# EAGLE design osbee_shield_1.0 (EAGLE 6.5.0)
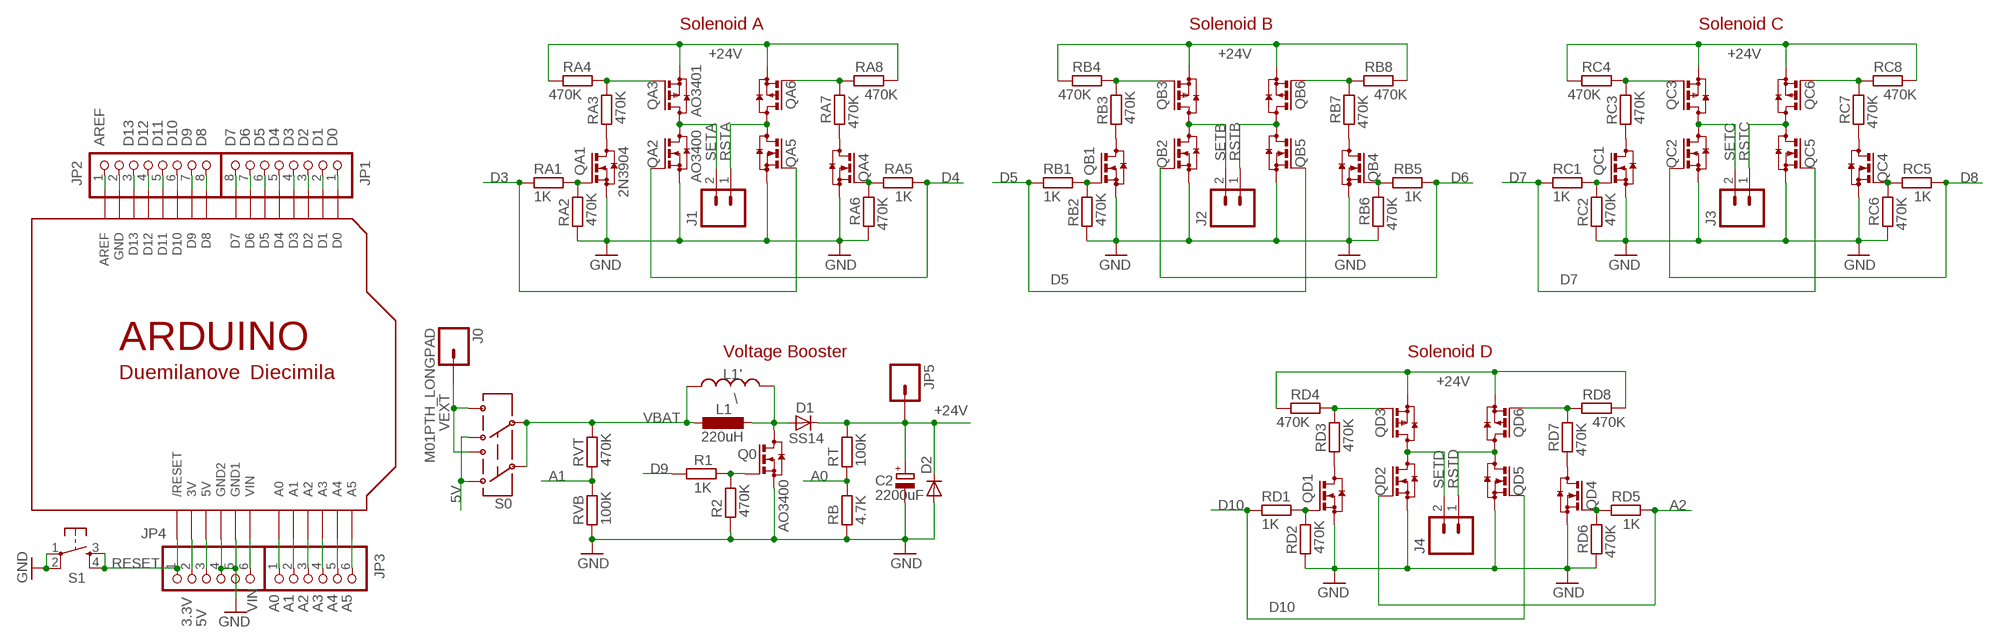
[diagram p0: schematic, sheet 1]

## Parts
C2  2200uF  CPOL-EUE5-13  [E5-13]
D1  SS14  DIODE-DO-214AC  [DO-214AC]
D2  DIODE-MINIMELF  [MINIMELF]
J0  M01PTH_LONGPAD  [1X01_LONGPAD]
J1  M025MM  [SCREWTERMINAL-5MM-2]
J2  M025MM  [SCREWTERMINAL-5MM-2]
J3  M025MM  [SCREWTERMINAL-5MM-2]
J4  M025MM  [SCREWTERMINAL-5MM-2]
JP1  PINHD-1X8BIG  [1X08-BIG]
JP2  PINHD-1X8BIG  [1X08-BIG]
JP3  PINHD-1X6B  [1X06-BIG]
JP4  PINHD-1X6B  [1X06-BIG]
JP5  M01SMDNS  [1X01NS]
L1  220uH  L-EU0204/5  [0204/5]
L1'  \  INDUCTOR_SMDD58  [INDUCTOR_D58]
Q0  AO3400  BSS123  [SOT23]
QA1  2N3904  BSS123  [SOT23]
QA2  AO3400  BSS123  [SOT23]
QA3  AO3401  BSS84  [SOT23]
QA4  BSS123  [SOT23]
QA5  BSS123  [SOT23]
QA6  BSS84  [SOT23]
QB1  BSS123  [SOT23]
QB2  BSS123  [SOT23]
QB3  BSS84  [SOT23]
QB4  BSS123  [SOT23]
QB5  BSS123  [SOT23]
QB6  BSS84  [SOT23]
QC1  BSS123  [SOT23]
QC2  BSS123  [SOT23]
QC3  BSS84  [SOT23]
QC4  BSS123  [SOT23]
QC5  BSS123  [SOT23]
QC6  BSS84  [SOT23]
QD1  BSS123  [SOT23]
QD2  BSS123  [SOT23]
QD3  BSS84  [SOT23]
QD4  BSS123  [SOT23]
QD5  BSS123  [SOT23]
QD6  BSS84  [SOT23]
R1  1K  R-EU_R0805  [R0805]
R2  470K  R-EU_R0805  [R0805]
RA1  1K  R-EU_R0805  [R0805]
RA2  470K  R-EU_R0805  [R0805]
RA3  470K  R-EU_R0805  [R0805]
RA4  470K  R-EU_R0805  [R0805]
RA5  1K  R-EU_R0805  [R0805]
RA6  470K  R-EU_R0805  [R0805]
RA7  470K  R-EU_R0805  [R0805]
RA8  470K  R-EU_R0805  [R0805]
RB  4.7K  R-EU_R0805  [R0805]
RB1  1K  R-EU_R0805  [R0805]
RB2  470K  R-EU_R0805  [R0805]
RB3  470K  R-EU_R0805  [R0805]
RB4  470K  R-EU_R0805  [R0805]
RB5  1K  R-EU_R0805  [R0805]
RB6  470K  R-EU_R0805  [R0805]
RB7  470K  R-EU_R0805  [R0805]
RB8  470K  R-EU_R0805  [R0805]
RC1  1K  R-EU_R0805  [R0805]
RC2  470K  R-EU_R0805  [R0805]
RC3  470K  R-EU_R0805  [R0805]
RC4  470K  R-EU_R0805  [R0805]
RC5  1K  R-EU_R0805  [R0805]
RC6  470K  R-EU_R0805  [R0805]
RC7  470K  R-EU_R0805  [R0805]
RC8  470K  R-EU_R0805  [R0805]
RD1  1K  R-EU_R0805  [R0805]
RD2  470K  R-EU_R0805  [R0805]
RD3  470K  R-EU_R0805  [R0805]
RD4  470K  R-EU_R0805  [R0805]
RD5  1K  R-EU_R0805  [R0805]
RD6  470K  R-EU_R0805  [R0805]
RD7  470K  R-EU_R0805  [R0805]
RD8  470K  R-EU_R0805  [R0805]
RT  100K  R-EU_R0805  [R0805]
RVB  100K  R-EU_R0805  [R0805]
RVT  470K  R-EU_R0805  [R0805]
S0  AYZ0202  [AYZ0202]
S1  TAC_SWITCHPTH  [TACTILE-PTH]
U$1  ARDUINODUEMILANOVE-NODIM  [ARDUINO-NODIM]

## Nets
3.3V: JP4.2 U$1.3V
5V [power]: JP4.3 S0.3 S0.6 U$1.5V
+24V [power]: C2.+ D1.C D2.C JP5.1 QA3.2(S) QA6.2(S) QB3.2(S) QB6.2(S) QC3.2(S) QC6.2(S) QD3.2(S) QD6.2(S) RA4.2 RA8.2 RB4.2 RB8.2 RC4.2 RC8.2 RD4.2 RD8.2 RT.2
A0: JP3.1 RB.2 RT.1 U$1.A0
A1: JP3.2 RVB.2 RVT.1 U$1.A1
A2: JP3.3 QD2.1(G) RD5.1 U$1.A2
A3: JP3.4 U$1.A3
A4: JP3.5 U$1.A4
A5: JP3.6 U$1.A5
AREF: JP2.1 U$1.AREF
D0: JP1.1 U$1.D0
D1: JP1.2 U$1.D1
D2: JP1.3 U$1.D2
D3: JP1.4 QA5.1(G) RA1.1 U$1.D3
D4: JP1.5 QA2.1(G) RA5.1 U$1.D4
D5: JP1.6 QB5.1(G) RB1.1 U$1.D5
D6: JP1.7 QB2.1(G) RB5.1 U$1.D6
D7: JP1.8 QC5.1(G) RC1.1 U$1.D7
D8: JP2.8 QC2.1(G) RC5.1 U$1.D8
D9: JP2.7 R1.2 U$1.D9
D10: JP2.6 QD5.1(G) RD1.1 U$1.D10
D11: JP2.5 U$1.D11
D12: JP2.4 U$1.D12
D13: JP2.3 U$1.D13
GND: C2.- D2.A JP4.4 JP4.5 Q0.2(S) QA1.2(S) QA2.2(S) QA4.2(S) QA5.2(S) QB1.2(S) QB2.2(S) QB4.2(S) QB5.2(S) QC1.2(S) QC2.2(S) QC4.2(S) QC5.2(S) QD1.2(S) QD2.2(S) QD4.2(S) QD5.2(S) R2.1 RA2.1 RA6.1 RB2.1 RB6.1 RB.1 RC2.1 RC6.1 RD2.1 RD6.1 RVB.1 S1.1 S1.2 U$1.GND1 U$1.GND2
N$1: QA1.3(D) RA3.1
N$2: Q0.1(G) R1.1 R2.2
N$3: QB1.1(G) RB1.2 RB2.2
N$4: JP2.2 U$1.GND
N$5: QB1.3(D) RB3.1
N$6: QB3.1(G) RB3.2 RB4.1
N$7: QA1.1(G) RA1.2 RA2.2
N$8: QB4.1(G) RB5.2 RB6.2
N$9: QA3.1(G) RA3.2 RA4.1
N$10: QA4.1(G) RA5.2 RA6.2
N$11 [power]: D1.A L1'.P$2 L1.2 Q0.3(D)
N$12: QB4.3(D) RB7.1
N$13: QA4.3(D) RA7.1
N$14: QA6.1(G) RA7.2 RA8.1
N$15: QB6.1(G) RB7.2 RB8.1
N$16: QC1.1(G) RC1.2 RC2.2
N$17: QC1.3(D) RC3.1
N$18: QC3.1(G) RC3.2 RC4.1
N$19: QC4.1(G) RC5.2 RC6.2
N$20: QC4.3(D) RC7.1
N$21: QC6.1(G) RC7.2 RC8.1
N$22: QD1.1(G) RD1.2 RD2.2
N$23: QD1.3(D) RD3.1
N$24: QD3.1(G) RD3.2 RD4.1
N$25: QD4.1(G) RD5.2 RD6.2
N$26: QD4.3(D) RD7.1
N$27: QD6.1(G) RD7.2 RD8.1
RESET: JP4.1 S1.3 S1.4 U$1.RESET(/RESET)
RSTA [power]: J1.1 QA5.3(D) QA6.3(D)
RSTB [power]: J2.1 QB5.3(D) QB6.3(D)
RSTC [power]: J3.1 QC5.3(D) QC6.3(D)
RSTD [power]: J4.1 QD5.3(D) QD6.3(D)
SETA [power]: J1.2 QA2.3(D) QA3.3(D)
SETB [power]: J2.2 QB2.3(D) QB3.3(D)
SETC [power]: J3.2 QC2.3(D) QC3.3(D)
SETD [power]: J4.2 QD2.3(D) QD3.3(D)
VBAT [power]: L1'.P$1 L1.1 RVT.2 S0.2 S0.5
VEXT [power]: J0.1 S0.1 S0.4
VIN: JP4.6 U$1.VIN

## Notes on the sheet
- Solenoid A | Solenoid B | Solenoid C
- Voltage Booster | Solenoid D

## Library data of the parts
C2 = rcl:CPOL-EU: POLARIZED CAPACITOR, European symbol
D1 D2 = diode:DIODE-: DIODE
J0 JP5 = SparkFun:M01: Header 1 Standard 1-pin 0.1" header. Use with straight break away headers (SKU : PRT-00116), right angle break away headers (PRT-00553), swiss pins (PRT-00743), machine pins (PRT-00117), and female headers (PRT-00115).
J1-J4 = SparkFun:M02: Header 2 Standard 2-pin 0.1" header. Use with straight break away headers (SKU : PRT-00116), right angle break away headers (PRT-00553), swiss pins (PRT-00743), machine pins (PRT-00117), and female headers (PRT-00115). Molex polarized connector foot print use with SKU : PRT-08233 with associated crimp pins and housings.
JP1 JP2 = adafruit:PINHD-1X8: PIN HEADER
JP3 JP4 = adafruit:PINHD-1X6: PIN HEADER
L1 = rcl:L-EU: INDUCTOR, European symbol
L1' = linear-technology:INDUCTOR_SMD
Q0 QA1 QA2 QA4 QA5 QB1 QB2 QB4 QB5 QC1 QC2 QC4 QC5 QD1 QD2 QD4 QD5 = transistor-small-signal:BSS123: N-CHANNEL MOS FET
QA3 QA6 QB3 QB6 QC3 QC6 QD3 QD6 = transistor-small-signal:BSS84: P-CHANNEL MOS FET
R1 R2 RA1-RA8 RB RB1-RB8 RC1-RC8 RD1-RD8 RT RVB RVT = rcl:R-EU_: RESISTOR, European symbol
S0 = SparkFunNew:AYZ0202: SPDT Slide Switch Simple SMD single-pull double-throw slide switch. Good for less than 350mA power switch, switching UARTs between devices, etc. Spark Fun Electronics SKU : COM-00597
S1 = SparkFun:TAC_SWITCH: Momentary Switch Button commonly used for reset or general input. Spark Fun Electronics SKU : COM-00097
U$1 = adafruit:ARDUINO: Arduino Diecimila/Duemilanove Make a shield with ease, this package has all the named pins as well as the two mounting drill holes and an outline of the USB and DC power connector. The outline is on the DIMENSION layer, so if your board house uses it they will cut the outline to match. http://www.ladyada.net/library/pcb/eaglelibrary.html

## Net classes
0 default: width 0.254 mm, clearance 0.203 mm
1 power: width 0.508 mm, clearance 0.203 mm

## Board
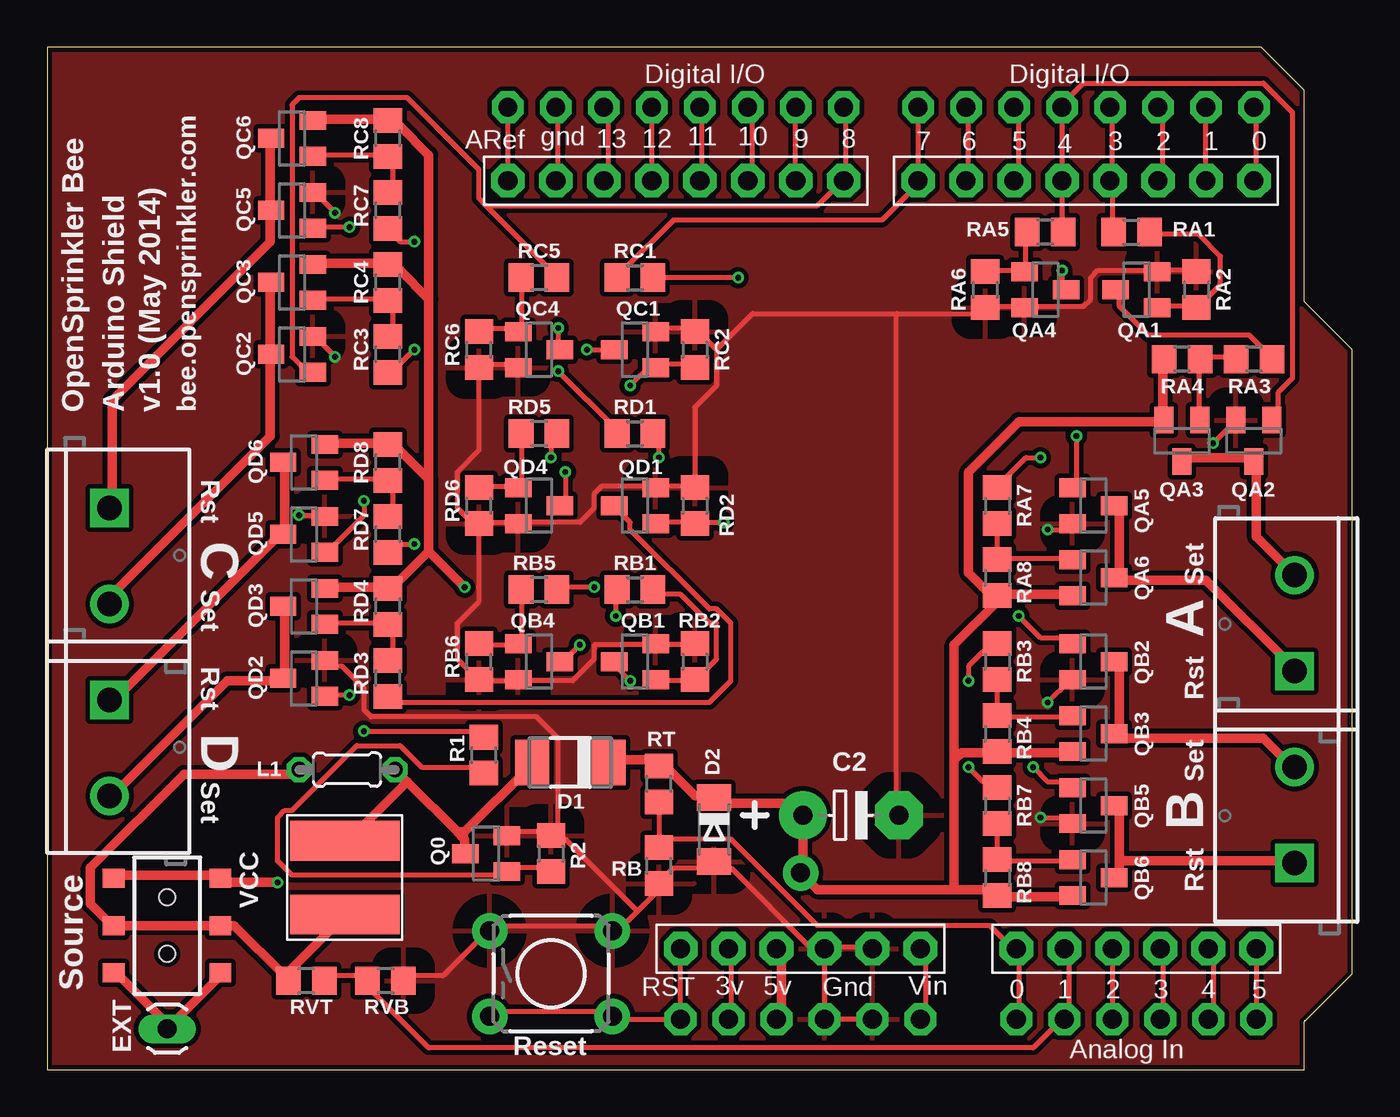
[diagram p1: board, top side]
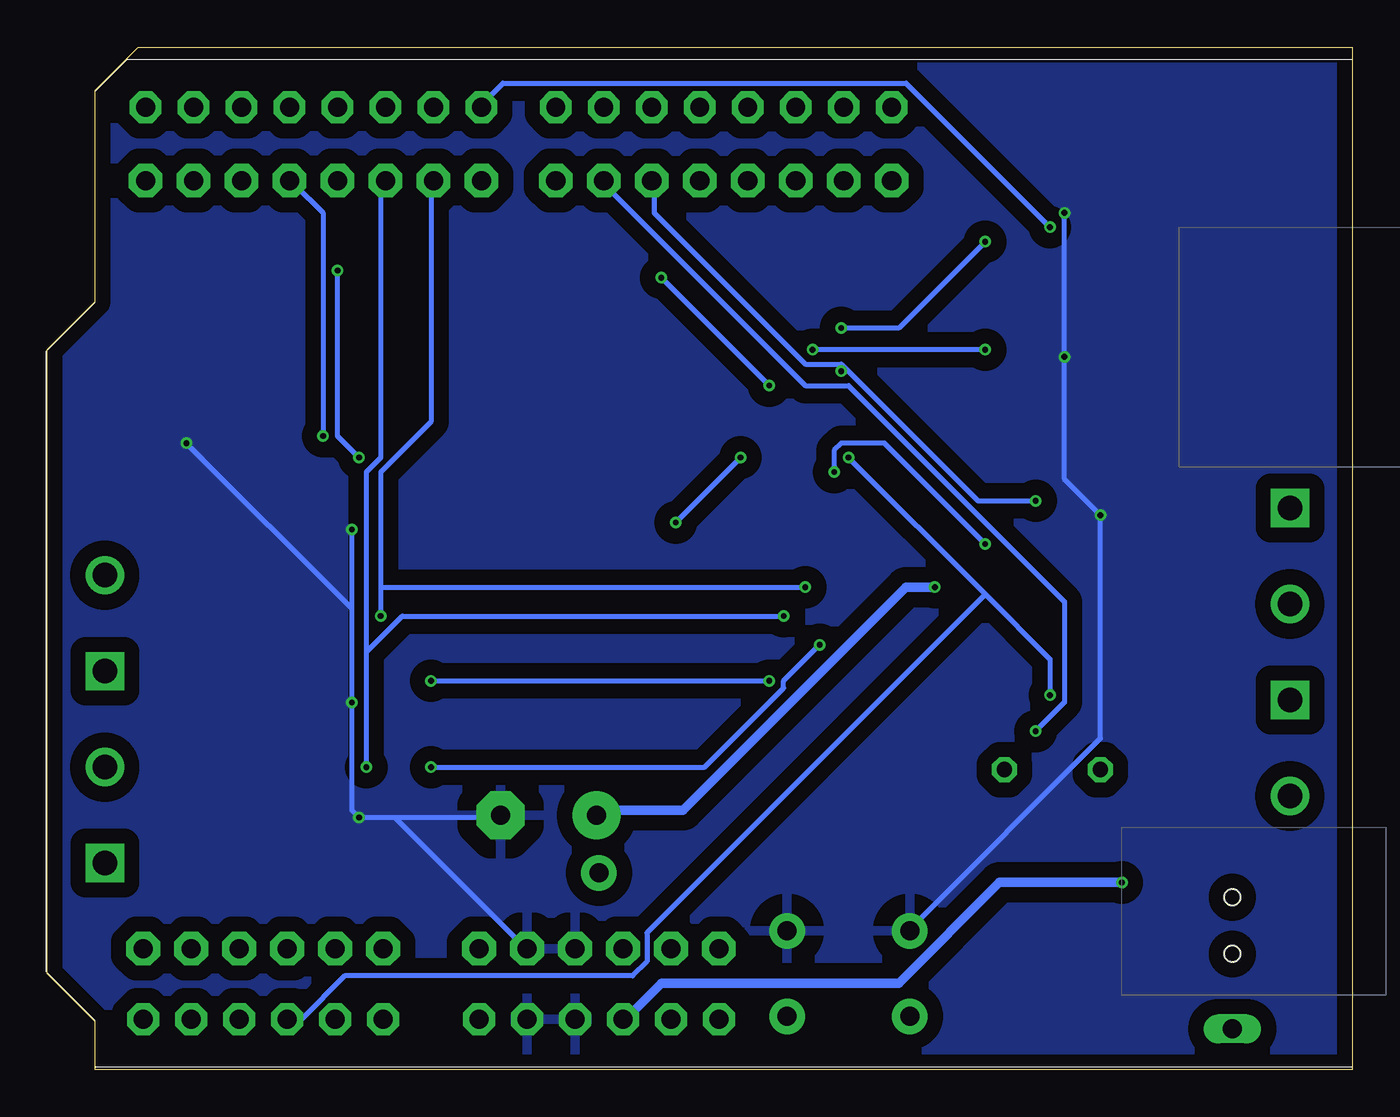
[diagram p2: board, bottom side, seen from below]

Size 69.09 x 54.1 mm. Coordinates in mm from the lower left corner, seen from the top.
Outline: 0,54.1 0,0 66.55,0 66.55,2.54 69.09,5.08 69.09,38.1 66.55,40.64 66.55,51.82 64.26,54.1 0,54.1
Copper layers (1*16): Top 0.035mm / dielectric 1.5mm / Bottom 0.035mm
Design rules "Fusion_eagle_rule_v1.1 *": minimum track width 6mil, minimum drill 12mil, track to track 6mil, track to pad 6mil, pad to pad 6mil, via to via 6mil, smd to smd 0mil, copper to edge 10mil, drill to drill 10mil, minimum pad ring 10mil, minimum via ring 6mil, stop-mask expansion 2mil, vias tented up to drill 100mil, thermal gap 40mil
vRestrict: area 57.7,24.9 to 58.4,27.2; area 24.1,31.5 to 26.2,32.3; area 30.5,23.4 to 32.3,24.1; area 10.2,8.6 to 11.2,11.7; area 16.3,27.2 to 17,29.7; area 30,39.9 to 32.5,40.6; area 24.6,39.9 to 26.9,40.6; area 51.3,12.7 to 52.1,15

### Footprints (pad centres in the part's own frame; a part is rotated, then mirrored left to right if it is on the bottom)
E5-13 = drill 1.016 pad 2.54: + -2.54,0 | drill 1.016 pad 2.54 octagon: - 2.54,0
DO-214AC = smd 1.8 x 2.4: A 2.025,0; C -2.025,0
MINIMELF = smd 1.4 x 1.8: A 1.7,0; C -1.7,0
1X01_LONGPAD = drill 1.016 long: 1 0,0
SCREWTERMINAL-5MM-2 = drill 1.3 pad 2.032 square: 1 0,0 | drill 1.3 pad 2.032: 2 5.08,0
1X08-BIG = drill 1.016 pad 1.778 octagon: 1 -8.89,0; 2 -6.35,0; 3 -3.81,0; 4 -1.27,0; 5 1.27,0; 6 3.81,0; 7 6.35,0; 8 8.89,0
1X06-BIG = drill 1.016 pad 1.778 octagon: 1 -6.35,0; 2 -3.81,0; 3 -1.27,0; 4 1.27,0; 5 3.81,0; 6 6.35,0
1X01NS = drill 1.016 pad 1.88: 1 0,0
0204/5 = drill 0.813 octagon: 1 -2.54,0; 2 2.54,0
INDUCTOR_D58 = smd 2.095 x 5.791: P$1 -1.95,0; P$2 1.95,0
SOT23 = smd 1 x 1.4: 1 -0.95,-1.1; 2 0.95,-1.1; 3 0,1.1
R0805 = smd 1.3 x 1.5: 1 -0.95,0; 2 0.95,0
AYZ0202 = smd 1 x 1.15: 1 -2.5,2.825; 2 0,2.825; 3 2.5,2.825; 4 -2.5,-2.825; 5 0,-2.825; 6 2.5,-2.825 | hole 0.85: 1.5,0; -1.5,0
TACTILE-PTH = drill 1.016 pad 1.88: 1 -3.251,2.261; 2 3.251,2.261; 3 -3.251,-2.261; 4 3.251,-2.261
ARDUINO-NODIM = drill 1 pad 1.676 octagon: 3V 36.068,2.54; 5V 38.608,2.54; A0 51.308,2.54; A1 53.848,2.54; A2 56.388,2.54; A3 58.928,2.54; A4 61.468,2.54; A5 64.008,2.54; AREF 24.384,50.8; D0 63.881,50.8; D1 61.341,50.8; D2 58.801,50.8; D3 56.261,50.8; D4 53.721,50.8; D5 51.181,50.8; D6 48.641,50.8; D7 46.101,50.8; D8 42.164,50.8; D9 39.624,50.8; D10 37.084,50.8; D11 34.544,50.8; D12 32.004,50.8; D13 29.464,50.8; GND 26.924,50.8; GND1 43.688,2.54; GND2 41.148,2.54; RESET 33.528,2.54; VIN 46.228,2.54

### Placement (x,y rotation side)
C2  42.55,13.46 0 top
D1  27.69,16.26 180 top
D2  35.31,12.7 270 top
J0  6.35,2.16 270 top
J1  66.04,21.08 90 top
J2  66.04,10.92 90 top
J3  3.3,29.72 270 top
J4  3.3,19.56 270 top
JP1  54.99,47.04 180 top
JP2  33.27,47.04 0 top
JP3  57.66,6.4 0 top
JP4  39.88,6.4 0 top
JP5  39.88,10.41 0 top
L1  15.88,15.88 0 top
L1'  15.75,10.16 90 top
Q0  23.24,11.43 90 top
QA1  57.66,41.27 90 top
QA2  63.88,33.27 180 top
QA3  60.07,33.27 180 top
QA4  52.83,41.27 270 top
QA5  55.37,29.84 270 top
QA6  55.37,26.04 270 top
QB1  31.11,21.59 90 top
QB2  55.37,21.59 270 top
QB3  55.37,17.78 270 top
QB4  26.04,21.59 270 top
QB5  55.37,13.97 270 top
QB6  55.37,10.16 270 top
QC1  31.11,38.1 90 top
QC2  12.95,37.85 90 top
QC3  12.95,41.66 90 top
QC4  26.04,38.1 270 top
QC5  12.95,45.47 90 top
QC6  12.95,49.28 90 top
QD1  31.11,29.84 90 top
QD2  13.59,20.7 90 top
QD3  13.59,24.51 90 top
QD4  26.04,29.84 270 top
QD5  13.59,28.32 90 top
QD6  13.59,32.13 90 top
R1  23.11,16.64 90 top
R2  26.67,11.43 270 top
RA1  57.4,44.32 0 top
RA2  60.83,41.27 270 top
RA3  63.88,37.59 180 top
RA4  60.07,37.59 180 top
RA5  52.83,44.32 180 top
RA6  49.66,41.27 90 top
RA7  50.29,29.84 270 top
RA8  50.29,26.04 270 top
RB  32.38,10.79 90 top
RB1  31.11,25.4 0 top
RB2  34.29,21.59 270 top
RB3  50.29,21.59 270 top
RB4  50.29,17.78 270 top
RB5  26.04,25.4 180 top
RB6  22.86,21.59 90 top
RB7  50.29,13.97 270 top
RB8  50.29,10.16 270 top
RC1  31.11,41.91 0 top
RC2  34.29,38.1 270 top
RC3  18.03,37.85 90 top
RC4  18.03,41.66 90 top
RC5  26.04,41.91 180 top
RC6  22.86,38.1 90 top
RC7  18.03,45.47 90 top
RC8  18.03,49.28 90 top
RD1  31.11,33.66 0 top
RD2  34.29,29.84 270 top
RD3  18.03,20.7 90 top
RD4  18.03,24.51 90 top
RD5  26.04,33.66 180 top
RD6  22.86,29.84 90 top
RD7  18.03,28.32 90 top
RD8  18.03,32.13 90 top
RT  32.38,15.11 90 top
RVB  17.91,4.7 180 top
RVT  13.72,4.7 180 top
S0  6.35,7.62 90 top
S1  26.67,5.08 0 top
U$1  0,0.13 0 top

### Tracks (layer width: path | path; a pad name or v marks a point on that pad's centre or on a via)
3.3V
  Top 0.254: U$1.3V 36.2,2.67 36.2,6.1 JP4.2
5V  (via drill 0.3)
  Top 0.508: S0.3 3.81,10.29 9.14,10.29 S0.6 9.53,9.91 v12.19,9.91 | JP4.3 38.86,6.1 38.86,2.67 U$1.5V
  Bottom 0.508: v12.19,9.91 18.67,9.91 24,4.57 36.58,4.57 38.48,2.67 U$1.5V
+24V  (via drill 0.3)
  Top 0.508: QC6.2 14.1,50.29 17.91,50.29 RC8.2 18.29,49.91 18.67,49.91 20.19,48.39 20.19,40.77 | QC3.2 14.1,42.67 17.91,42.67 RC4.2 18.29,42.29 18.67,42.29 20.19,40.77 | QD3.2 14.86,25.53 17.91,25.53 RD4.2 18.29,25.53 20.19,27.43 | QD6.2 14.86,33.15 17.91,33.15 RD8.2 18.29,33.15 20.19,31.24 | 20.19,31.24 20.19,27.43 | 20.19,31.24 20.19,40.77 | RA4.2 59.05,37.34 59.05,34.67 QA3.2 59.05,34.29 51.44,34.29 48.77,31.62 48.77,26.29 50.29,24.77 | QA6.2 54.1,25.15 50.29,25.15 RA8.2 50.29,24.77 | 32.38,16.38 29.72,16.38 D1.C | 32.38,16.38 34.29,14.48 35.05,14.48 D2.C 35.43,14.1 39.62,14.1 40.01,13.72 C2.+ 40.01,10.67 JP5.1 40.77,9.53 48.01,9.53 | 32.38,16.38 RT.2 | 50.29,16.76 54.1,16.76 QB3.2 | QB6.2 54.1,9.14 50.29,9.14 RB8.2 50.29,9.53 48.01,9.53 | 50.29,16.76 48.39,16.76 48.01,16.38 | 48.01,9.53 48.01,16.38 | 50.29,16.76 RB4.2 | 50.29,24.77 48.01,22.48 48.01,16.38 | v22.1,25.53 20.19,27.43
  Bottom 0.508: v22.1,25.53 23.62,25.53 35.43,13.72 40.01,13.72 C2.+
A0
  Top 0.254: RT.1 32.38,12.19 | 32.38,12.19 RB.2 32.38,11.81 | 32.38,12.19 36.2,12.19 40.77,7.62 49.91,7.62 51.05,6.48 JP3.1 51.44,6.1 51.44,2.67 U$1.A0
A1
  Top 0.254: RVT.1 14.86,4.95 16.76,4.95 RVB.2 17.14,4.57 17.14,4.19 20.19,1.14 52.2,1.14 53.72,2.67 U$1.A1 54.1,2.67 54.1,6.1 JP3.2
A2  (via drill 0.3)
  Top 0.254: JP3.3 U$1.A2 | v16,19.81 14.86,19.81 QD2.1 | v26.67,32.38 26.67,33.53 RD5.1
  Bottom 0.254: v16,19.81 16,21.72 19.43,25.15 | v26.67,32.38 19.43,25.15 | U$1.A2 55.63,2.67 53.34,4.95 38.1,4.95 37.34,5.71 37.34,7.24 19.43,25.15
A3
  Top 0.254: U$1.A3 59.05,2.67 59.05,6.1 JP3.4
A4
  Top 0.254: U$1.A4 61.72,2.67 61.72,6.1 JP3.5
A5
  Top 0.254: JP3.6 U$1.A5
AREF
  Top 0.254: JP2.1 U$1.AREF
D0
  Top 0.254: U$1.D0 64.01,50.67 64.01,47.24 JP1.1
D1
  Top 0.254: JP1.2 U$1.D1
D2
  Top 0.254: U$1.D2 59.05,50.67 59.05,47.24 JP1.3
D3  (via drill 0.3)
  Top 0.254: v54.48,33.53 54.48,30.86 QA5.1 | RA1.1 56.39,44.58 56.39,46.86 JP1.4 56.39,47.24 56.39,50.67 U$1.D3
  Bottom 0.254: v54.48,33.53 54.48,45.34 56.01,46.86 JP1.4
D4
  Top 0.254: RA5.1 53.72,44.58 JP1.5 U$1.D4 53.72,51.05 54.86,52.2 64.39,52.2 65.91,50.67 65.91,36.58 65.15,35.81 65.15,34.67 QA2.1
D5  (via drill 0.3)
  Top 0.254: v52.2,16 52.96,15.24 54.1,15.24 QB5.1 | v30.1,24 30.1,25.15 RB1.1 | U$1.D5 51.44,50.67 51.44,47.24 JP1.6
  Bottom 0.254: 52.2,22.1 52.2,31.62 51.44,32.38 51.44,46.86 JP1.6 | 52.2,22.1 v52.2,16 | v30.1,24 50.29,24 52.2,22.1
D6  (via drill 0.3)
  Top 0.254: v51.44,24 52.58,22.86 54.1,22.86 QB2.1 | v28.96,25.53 27.05,25.53 RB5.1 | U$1.D6 48.77,50.67 48.77,47.24 JP1.7
  Bottom 0.254: 51.44,25.53 51.44,31.62 48.77,34.29 48.77,46.86 JP1.7 | 51.44,25.53 v51.44,24 | 51.44,25.53 v28.96,25.53
D7  (via drill 0.3)
  Top 0.254: RC1.1 30.48,41.91 30.48,42.29 33.15,44.96 44.2,44.96 46.1,46.86 JP1.8 U$1.D7 | v16,44.58 14.1,44.58 QC5.1
  Bottom 0.254: v16,44.58 23.62,52.2 44.96,52.2 46.1,51.05 U$1.D7
D8
  Top 0.254: U$1.D8 42.29,50.67 42.29,47.24 JP2.8 41.91,46.86 40.77,45.72 23.24,45.72 | 23.24,45.72 27.05,41.91 RC5.1 | 23.24,45.72 22.86,46.1 22.86,47.62 19.05,51.44 13.34,51.44 12.95,51.05 12.95,37.72 13.72,36.96 QC2.1
D9  (via drill 0.3)
  Top 0.254: v16.76,17.91 22.86,17.91 R1.2 | JP2.7 U$1.D9
  Bottom 0.254: v16.76,17.91 15.24,19.43 15.24,24.77 26.67,36.2 28.96,36.2 39.62,46.86 JP2.7
D10  (via drill 0.3)
  Top 0.254: v16.76,30.1 16.76,29.34 14.86,27.43 QD5.1 | v27.05,36.96 30.1,33.91 RD1.1 | U$1.D10 37.34,50.67 37.34,47.24 JP2.6
  Bottom 0.254: v16.76,30.1 19.81,30.1 26.67,36.96 | 26.67,36.96 27.05,37.34 28.96,37.34 36.96,45.34 36.96,46.86 JP2.6 | 26.67,36.96 v27.05,36.96
D11
  Top 0.254: U$1.D11 34.67,50.67 34.67,47.24 JP2.5
D12
  Top 0.254: JP2.4 U$1.D12
D13
  Top 0.254: U$1.D13 29.72,50.67 29.72,47.24 JP2.3
GND  (via drill 0.3)
  Top 0.254: QC4.2 24.77,37.34 22.86,37.34 RC6.1 22.86,32.77 21.72,31.62 21.72,29.72 22.86,28.57 | 22.86,20.57 24.77,20.57 QB4.2 25.15,20.57 27.81,20.57 28.96,21.72 28.96,22.48 32,22.48 QB1.2 32.38,22.48 34.29,22.48 RB2.1 | 22.86,28.57 22.86,24.77 21.72,23.62 21.72,21.72 22.86,20.57 | 22.86,20.57 RB6.1 | 22.86,28.57 RD6.1 22.86,28.96 24.77,28.96 QD4.2 25.15,28.96 28.19,28.96 28.96,29.72 28.96,30.48 29.34,30.86 32,30.86 QD1.2 32.38,30.86 34.29,30.86 | RA2.1 60.58,42.29 59.05,42.29 QA1.2 58.67,42.29 55.63,42.29 55.24,41.91 55.24,40.77 54.86,40.39 51.82,40.39 QA4.2 51.44,40.39 49.91,40.39 RA6.1 49.53,40.01 44.96,40.01 | 34.29,39.24 32.38,39.24 QC1.2 | 34.29,30.86 34.29,35.05 35.43,36.2 35.43,38.1 | 34.29,39.24 35.43,38.1 | 34.29,30.86 RD2.1 | 34.29,39.24 RC2.1 | 44.96,40.01 37.34,40.01 35.43,38.1 | U$1.GND1 U$1.GND2 JP4.4 41.15,6.48 | 41.15,6.48 43.43,6.48 JP4.5 | v52.58,13.34 54.1,13.34 QB5.2 | v52.96,19.43 54.1,20.57 QB2.2 | v52.96,28.57 54.1,28.57 QA5.2 | v61.72,33.15 62.87,34.29 QA2.2 | 26.67,12.57 27.05,12.95 27.05,17.53 25.91,18.67 17.14,18.67 16.76,19.05 16.76,20.19 15.62,21.34 14.86,21.34 QD2.2 | 26.67,12.57 24.38,12.57 Q0.2 | 26.67,12.57 R2.1 26.67,12.19 27.43,12.19 31.24,8.38 | 31.24,8.38 30.1,7.24 S1.2 29.72,7.62 23.62,7.62 S1.1 23.24,7.24 20.95,4.95 19.05,4.95 RVB.1 | 31.24,8.38 32.38,9.53 RB.1 32.38,9.91 33.15,10.67 35.05,10.67 D2.A 35.43,10.67 36.2,10.67 40.39,6.48 41.15,6.48 | v13.34,29.34 14.48,29.34 QD5.2 | v15.24,37.72 14.48,38.48 14.1,38.48 QC2.2 | v15.24,45.34 14.48,46.1 14.1,46.1 QC5.2 | 44.96,40.01 44.96,13.72 C2.-
  Bottom 0.254: 50.67,13.34 45.34,13.34 C2.- | 50.67,13.34 v52.58,13.34 52.96,13.72 v52.96,19.43 52.96,24.38 | 52.96,24.38 v52.96,28.57 | 52.96,24.38 v61.72,33.15 | 50.67,13.34 43.81,6.48 JP4.5 | S1.1 23.24,7.62 13.34,17.53 v13.34,29.34 15.24,31.24 v15.24,37.72 v15.24,45.34
  pour Top (isolate 0.254): 0,54.61 69.85,54.61 69.85,0 0,0
  pour Bottom (isolate 0.813): 0,54.61 69.85,54.61 69.85,0 0,0
N$1
  Top 0.254: QA1.3 56.77,41.15 56.77,40.39 58.29,38.86 63.63,38.86 64.77,37.72 RA3.1
N$2
  Top 0.254: R2.2 26.67,10.67 24.38,10.67 Q0.1 24,10.29 12.95,10.29 12.19,11.05 12.19,13.34 12.57,13.72 12.95,13.72 16.38,17.14 18.67,17.14 19.81,16 22.86,16 R1.1
N$3
  Top 0.254: 32,25.53 RB1.2 32.38,25.15 33.53,25.15 35.05,23.62 35.43,23.62 35.43,21.72 34.29,20.57 | 34.29,20.57 32.38,20.57 QB1.1 | 34.29,20.57 RB2.2
N$4
  Top 0.254: U$1.GND 27.05,50.67 27.05,47.24 JP2.2
N$5  (via drill 0.3)
  Top 0.254: v30.86,20.57 30.1,21.34 QB1.3 | v48.77,20.57 48.77,21.34 50.29,22.86 RB3.1
  Bottom 0.254: v48.77,20.57 v30.86,20.57
N$6
  Top 0.254: QB3.1 54.1,18.67 50.29,18.67 RB4.1 RB3.2
N$7
  Top 0.254: 58.29,44.58 RA1.2 58.67,44.2 60.96,44.2 62.1,43.05 62.1,41.53 60.96,40.39 RA2.2 60.58,40.39 59.05,40.39 QA1.1
N$8
  Top 0.254: 25.15,25.53 RB5.2 25.15,25.15 25.15,22.86 QB4.1 24.77,22.48 22.86,22.48 RB6.2
N$9
  Top 0.254: QA3.1 60.96,34.67 60.96,37.34 RA4.1 61.34,37.72 62.87,37.72 RA3.2
N$10
  Top 0.254: 51.82,44.58 RA5.2 51.82,44.2 51.82,42.29 QA4.1 51.44,42.29 49.91,42.29 RA6.2
N$11
  Top 0.508: L1.2 19.05,15.24 | 19.05,15.24 21.72,12.57 | 21.72,12.57 22.1,12.19 22.1,11.43 Q0.3 | 21.72,12.57 22.1,12.57 25.53,16 D1.A | 19.05,15.24 16,12.19 L1'.P$2
N$12  (via drill 0.3)
  Top 0.254: v28.19,22.48 27.43,21.72 QB4.3 | v48.77,16 49.53,15.24 50.29,15.24 RB7.1
  Bottom 0.254: v28.19,22.48 30.1,20.57 30.1,20.19 34.29,16 v48.77,16
N$13  (via drill 0.3)
  Top 0.254: v53.72,42.29 53.72,41.53 QA4.3 | v52.58,32.38 51.82,32.38 50.29,30.86 RA7.1
  Bottom 0.254: v53.72,42.29 53.72,33.53 v52.58,32.38
N$14
  Top 0.254: 50.29,27.05 54.1,27.05 QA6.1 | 50.29,27.05 RA7.2 | 50.29,27.05 RA8.1
N$15
  Top 0.254: QB6.1 54.1,11.05 50.29,11.05 RB8.1 RB7.2
N$16  (via drill 0.3)
  Top 0.254: 32,41.91 RC1.2 v36.58,41.91 | RC2.2 34.29,37.34 32.38,37.34 QC1.1 32,37.34 v30.86,36.2
  Bottom 0.254: v30.86,36.2 v36.58,41.91
N$17  (via drill 0.3)
  Top 0.254: v28.57,38.1 QC1.3 | v19.43,38.1 18.29,36.96 RC3.1
  Bottom 0.254: v19.43,38.1 v28.57,38.1
N$18
  Top 0.254: QC3.1 14.1,40.77 17.91,40.77 RC4.1 18.29,40.39 18.29,38.86 RC3.2
N$19
  Top 0.254: RC6.2 22.86,39.24 24.77,39.24 QC4.1 25.15,39.24 25.15,41.91 RC5.2
N$20  (via drill 0.3)
  Top 0.254: v27.05,39.24 27.05,38.1 QC4.3 | v19.43,43.81 18.67,43.81 18.29,44.2 RC7.1
  Bottom 0.254: v27.05,39.24 24,39.24 v19.43,43.81
N$21
  Top 0.254: QC6.1 14.1,48.39 17.91,48.39 RC8.1 18.29,48.01 18.29,46.48 RC7.2
N$22  (via drill 0.3)
  Top 0.254: 32,33.91 RD1.2 32.38,33.53 v32.38,32.38 | 34.29,28.96 32.38,28.96 QD1.1 | 34.29,28.96 v35.81,28.96 | 34.29,28.96 RD2.2
  Bottom 0.254: v35.81,28.96 v32.38,32.38
N$23
  Top 0.254: QD1.3 30.1,29.72 30.86,28.96 30.86,28.57 35.05,24.38 35.43,24.38 36.2,23.62 36.2,20.57 35.05,19.43 18.29,19.43 RD3.1
N$24
  Top 0.254: QD3.1 14.86,23.62 17.91,23.62 RD4.1 18.29,23.24 18.29,21.72 RD3.2
N$25
  Top 0.254: 25.15,33.91 RD5.2 25.15,33.53 25.15,30.86 QD4.1 24.77,30.86 22.86,30.86 RD6.2
N$26  (via drill 0.3)
  Top 0.254: v27.43,31.62 27.43,30.1 QD4.3 | v19.43,27.81 18.67,27.81 18.29,27.43 RD7.1
  Bottom 0.254: v27.43,31.62 27.43,32.77 27.05,33.15 24.77,33.15 v19.43,27.81
N$27
  Top 0.254: QD6.1 14.86,31.24 17.91,31.24 RD8.1 18.29,30.86 18.29,29.34 RD7.2
RESET
  Top 0.254: JP4.1 U$1.RESET 30.1,2.67 S1.4 29.72,3.05 23.62,3.05 S1.3
RSTA
  Top 0.508: QA5.3 56.77,29.72 56.77,26.29 QA6.3 56.77,25.91 61.34,25.91 65.91,21.34 J1.1
RSTB
  Top 0.508: 56.77,11.05 56.77,13.72 QB5.3 | 56.77,11.05 56.77,10.29 QB6.3 | 56.77,11.05 65.91,11.05 J2.1
RSTC
  Top 0.508: QC6.3 11.81,49.15 11.81,45.72 QC5.3 11.81,45.34 11.81,43.81 3.43,35.43 3.43,29.72 J3.1
RSTD
  Top 0.508: QD6.3 12.57,32 12.57,28.57 QD5.3 12.19,28.19 3.43,19.43 J4.1
SETA
  Top 0.508: QA3.3 60.2,32.38 63.63,32.38 QA2.3 64.01,32 64.01,28.19 J1.2
SETB
  Top 0.508: QB2.3 56.77,21.34 56.77,17.91 QB3.3 56.77,17.53 64.39,17.53 65.91,16 J2.2
SETC
  Top 0.508: QC3.3 11.81,41.53 11.81,38.1 QC2.3 11.81,37.72 11.81,33.53 3.05,24.77 J3.2
SETD
  Top 0.508: QD3.3 12.57,24.38 12.57,20.95 QD2.3 12.19,20.57 9.53,20.57 3.43,14.48 J4.2
VBAT
  Top 0.508: 12.57,4.95 9.91,7.62 S0.5 S0.2 3.43,7.62 2.29,8.76 2.29,10.67 7.24,15.62 13.34,15.62 L1.1 | 12.57,4.95 15.62,8 L1'.P$1 | 12.57,4.95 RVT.2
VEXT
  Top 0.508: 6.48,2.29 3.81,4.95 S0.1 | 6.48,2.29 9.14,4.95 S0.4 | 6.48,2.29 J0.1
VIN
  Top 0.254: U$1.VIN 46.48,2.67 46.48,6.1 JP4.6

### Text on the board
tNames: OpenSprinkler Bee | Arduino Shield | v1.0 (May 2014) | bee.opensprinkler.com | Rst | C | Set | Set | A | Rst | Rst | D | Set | Set | B | VCC | Rst | Source | EXT | Reset